# EAGLE design MEchaduino_03 (EAGLE 9.0.0)
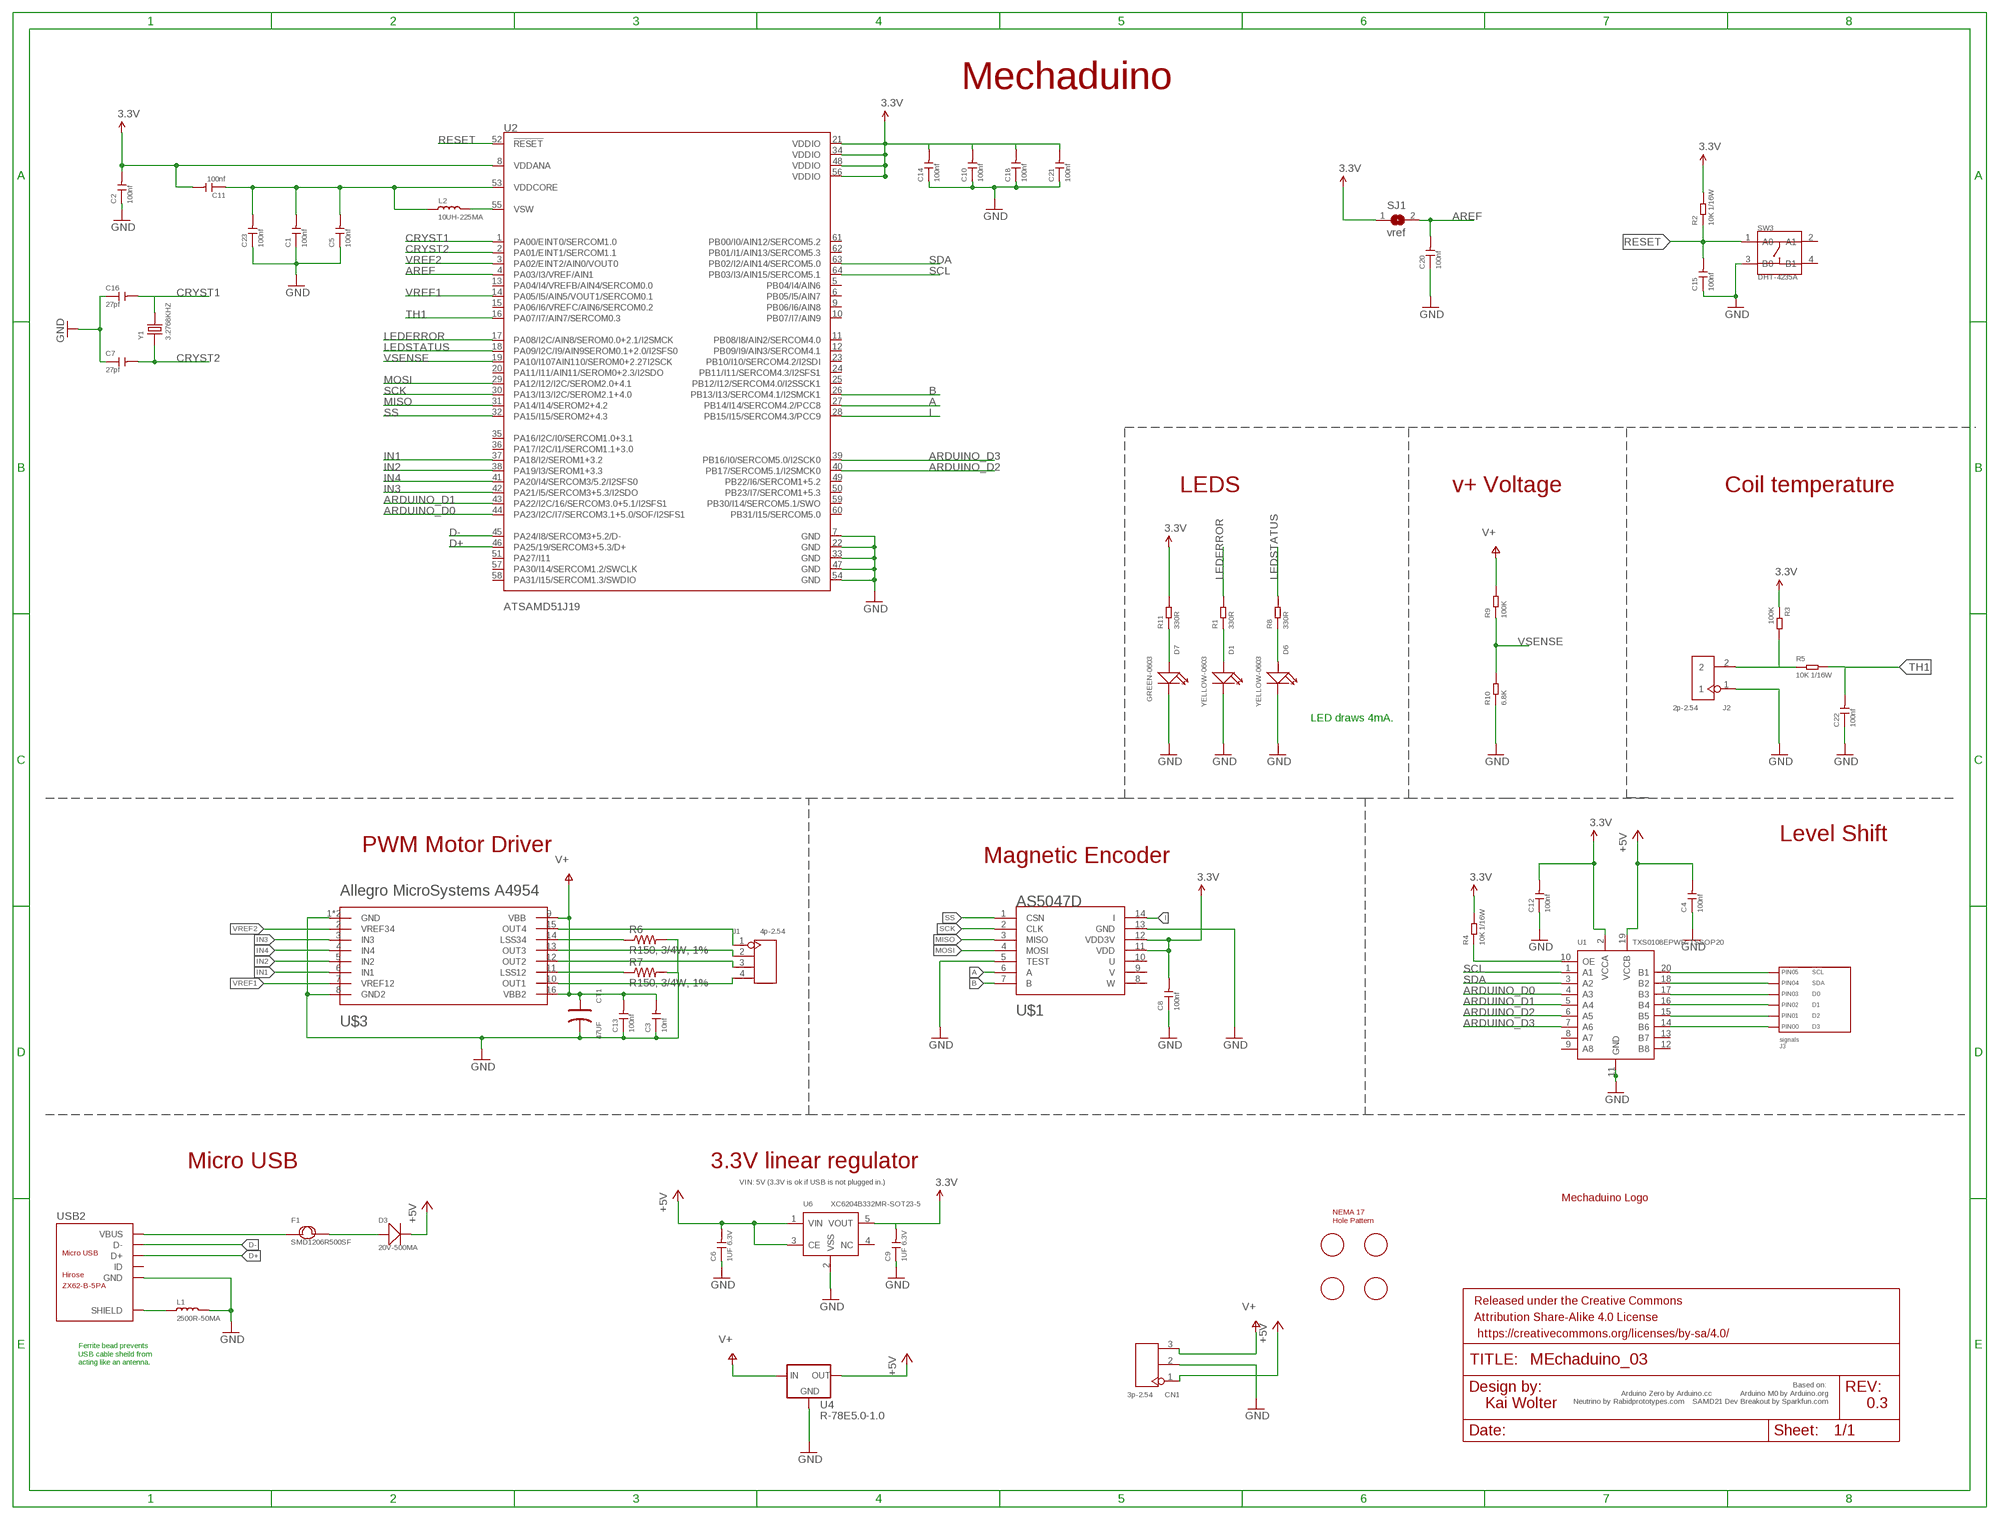
[diagram p0: schematic, sheet 1]

## Parts
C1  100nf  CERAMIC-100NF-25V-10%-X7R(0402)  [C0402]
C2  100nf  CERAMIC-100NF-25V-10%-X7R(0402)  [C0402]
C3  10nf  CERAMIC-10NF-50V-10%-X7R(0603)  [C0603]
C4  100nf  CERAMIC-100NF-25V-10%-X7R(0402)  [C0402]
C5  100nf  CERAMIC-100NF-25V-10%-X7R(0402)  [C0402]
C6  1UF 6.3V  CERAMIC-1UF-6.3V-10%-X5R(0402)  [C0402]
C7  27pf  CERAMIC-27PF-50V-5%-NPO(0402)  [C0402]
C8  100nf  CERAMIC-100NF-25V-10%-X7R(0402)  [C0402]
C9  1UF 6.3V  CERAMIC-1UF-6.3V-10%-X5R(0402)  [C0402]
C10  100nf  CERAMIC-100NF-25V-10%-X7R(0402)  [C0402]
C11  100nf  CERAMIC-100NF-25V-10%-X7R(0402)  [C0402]
C12  100nf  CERAMIC-100NF-25V-10%-X7R(0402)  [C0402]
C13  100nf  CERAMIC-100NF-50V-10%-X7R(0603)  [C0603]
C14  100nf  CERAMIC-100NF-25V-10%-X7R(0402)  [C0402]
C15  100nf  CERAMIC-100NF-25V-10%-X7R(0402)  [C0402]
C16  27pf  CERAMIC-27PF-50V-5%-NPO(0402)  [C0402]
C18  100nf  CERAMIC-100NF-25V-10%-X7R(0402)  [C0402]
C20  100nf  CERAMIC-100NF-25V-10%-X7R(0402)  [C0402]
C21  100nf  CERAMIC-100NF-25V-10%-X7R(0402)  [C0402]
C22  100nf  CERAMIC-100NF-25V-10%-X7R(0402)  [C0402]
C23  100nf  CERAMIC-100NF-25V-10%-X7R(0402)  [C0402]
CN1  3p-2.54  DIP-BLACK-MALE-HEADER-VERT(3P-2.54)  [H3-2.54]
CT1  47UF  ALUMINUM-SMD-47UF-25V(D6.3-H5.3MM)  [ELECTRO-SMD-C-6MM]
D1  YELLOW-0603  SMD-LED-CLEAR-YELLOW(0603)  [LED-0603]
D3  20V-500MA  SMD-DIODE-SCHOTTKY-20V-500MA(SOD-123)  [SOD-123]
D6  YELLOW-0603  SMD-LED-CLEAR-YELLOW(0603)  [LED-0603]
D7  GREEN-0603  SMD-LED-CLEAR-GREEN(0603)  [LED-0603]
F1  SMD1206R500SF  SMD-PPTC-500MA(1206)  [F1206]
FRAME1  FRAME-LEDGER  [CREATIVE_COMMONS]
J1  4p-2.54  DIP-BLACK-MALE-HEADER-VERT(4P-2.54)  [H4-2.54]
J2  2p-2.54  DIP-BLACK-MALE-HEADER-VERT(2P-2.54)  [H2-2.54]
J3  signals  HEADER_01X06_PTH_2.54MM  [PTH_2.54MM_01X06]
L1  2500R-50MA  SMD-FERRITE-BEAD-2500R-50MA(0603)  [L0603]
L2  10UH-225MA  SMD-INDUCTOR-10UH-225MA-10%(0806)  [L0806]
R1  330R  SMD-RES-330R-1%-1/16W(0402)  [R0402]
R2  10K 1/16W  SMD-RES-10K-1%-1/16W(0402)  [R0402]
R3  100K  SMD-RES-100K-1%-1/16W(0402)  [R0402]
R4  10K 1/16W  SMD-RES-10K-1%-1/16W(0402)  [R0402]
R5  10K 1/16W  SMD-RES-10K-1%-1/16W(0402)  [R0402]
R6  R150, 3/4W, 1%  R-US_R1206  [R1206]
R7  R150, 3/4W, 1%  R-US_R1206  [R1206]
R8  330R  SMD-RES-330R-1%-1/16W(0402)  [R0402]
R9  100K  SMD-RES-100K-1%-1/16W(0402)  [R0402]
R10  6.8K  SMD-RES-6.8K-1%-1/10W(0603)  [R0603]
R11  330R  SMD-RES-330R-1%-1/16W(0402)  [R0402]
SJ1  vref  SJ  [SJ]
SW3  DHT-4235A  SMD-BUTTON-TOP-DHT-4235A(4P-4.2X3.2MM)  [SW4-SMD-4.2X3.2X2.5MM]
U1  TXS0108EPWR-TSSOP20  LOGIC-TXS0108EPWR(TSSOP20)  [TSSOP20-0.65-6.5X4.4MM]
U2  ATSAMD51J19  [TQFP64]
U4  R-78E5.0-1.0  [DC-DC_CONVERTER_78XX]
U6  XC6204B332MR-SOT23-5  PMIC-LDO-XC6204B332MR(SOT23-5)  [SOT-23-5]
U$1  AS5047D  [TSSOP14]
U$2  NEMA17_HOLE_PATTERNNEW  [NEMA17_HOLE_PATTERN_2]
U$3  Allegro MicroSystems A4954  AVAGO_DRIVERTHERM  [TSSOP16_THERM]
U$4  MECHADUINO_LOGO  [MECHADUINO_LOGO]
USB2  ZX62-B-5PA  MICRO-USB-SMD(ZX62-B-5PA)  [MICRO-USB5+6P-SMD-0.65-AB]
Y1  3.2768KHZ  SMD-CRYSTAL-32.768KHZ-12.5PF-20PPM-90K(2P-L2.0X1.2MM)  [X2-SMD-L2.0X1.2X0.55MM]

## Nets
3.3V: C2.2 C8.2 C9.2 C10.2 C11.2 C12.2 C14.2 C18.2 C21.2 R2.2 R3.1 R4.2 R11.2 SJ1.1 U1.2(VCCA) U2.8(VDDANA) U2.21(VDDIO) U2.34(VDDIO) U2.48(VDDIO) U2.56(VDDIO) U6.5(VOUT) U$1.11(VDD) U$1.12(VDD3V)
+5V: C4.2 C6.2 CN1.1 D3.- U1.19(VCCB) U4.VOUT(OUT) U6.1(VIN) U6.3(CE)
A: U2.27(PB14/I14/SERCOM4.2/PCC8) U$1.6(A)
ARDUINO_D0: U1.4(A3) U2.44(PA23/I2C/I7/SERCOM3.1+5.0/SOF/I2SFS1)
ARDUINO_D1: U1.5(A4) U2.43(PA22/I2C/16/SERCOM3.0+5.1/I2SFS1)
ARDUINO_D2: U1.6(A5) U2.40(PB17/SERCOM5.1/I2SMCK0)
ARDUINO_D3: U1.7(A6) U2.39(PB16/I0/SERCOM5.0/I2SCK0)
AREF: C20.2 SJ1.2 U2.4(PA03/I3/VREF/AIN1)
B: U2.26(PB13/I13/SERCOM4.1/I2SMCK1) U$1.7(B)
CRYST1: C16.2 U2.1(PA00/EINT0/SERCOM1.0) Y1.2
CRYST2: C7.2 U2.2(PA01/EINT1/SERCOM1.1) Y1.1
D+ [USBpair]: U2.46(PA25/19/SERCOM3+5.3/D+) USB2.3(D+)
D- [USBpair]: U2.45(PA24/I8/SERCOM3+5.2/D-) USB2.2(D-)
GND [gnd]: C1.1 C2.1 C3.1 C4.1 C5.1 C6.1 C7.1 C8.1 C9.1 C10.1 C12.1 C13.1 C14.1 C15.1 C16.1 C18.1 C20.1 C21.1 C22.1 C23.1 CN1.2 CT1.- D1.- D6.- D7.- J2.1 L1.2 R6.2 R7.2 R10.1 SW3.3(B0) U1.11(GND) U2.7(GND) U2.22(GND) U2.33(GND) U2.47(GND) U2.54(GND) U4.GND U6.2(VSS) U$1.5(TEST) U$1.13(GND) U$3.1(GND) U$3.8(GND2) U$3.P$1(GND) USB2.5(GND)
I: U2.28(PB15/I15/SERCOM4.3/PCC9) U$1.14(I)
I_SENSE_COIL_A: R7.1 U$3.11(LSS12)
I_SENSE_COIL_B: R6.1 U$3.14(LSS34)
IN1: U2.37(PA18/I2/SEROM1+3.2) U$3.6(IN1)
IN2: U2.38(PA19/I3/SEROM1+3.3) U$3.5(IN2)
IN3: U2.42(PA21/I5/SERCOM3+5.3/I2SDO) U$3.3(IN3)
IN4: U2.41(PA20/I4/SERCOM3/5.2/I2SFS0) U$3.4(IN4)
LEDERROR: R1.2 U2.17(PA08/I2C/AIN8/SEROM0.0+2.1/I2SMCK)
LEDSTATUS: R8.2 U2.18(PA09/I2C/I9/AIN9SEROM0.1+2.0/I2SFS0)
MISO: U2.31(PA14/I14/SEROM2+4.2) U$1.3(MISO)
MOSI: U2.29(PA12/I12/I2C/SEROM2.0+4.1) U$1.4(MOSI)
N$1: D6.+ R8.1
N$2: J3.P$4(PIN3) U1.17(B3)
N$3: D1.+ R1.1
N$4: J3.P$3(PIN2) U1.16(B4)
N$5: J3.P$2(PIN1) U1.15(B5)
N$6: R4.1 U1.10(OE)
N$7: J3.P$1(PIN0) U1.14(B6)
N$8: C1.2 C5.2 C11.1 C23.2 L2.1 U2.53(VDDCORE)
N$9: J3.P$6(PIN5) U1.20(B1)
N$10: L2.2 U2.55(VSW)
N$11: D7.+ R11.1
N$12: D3.+ F1.2
N$13: J1.1 U$3.15(OUT4)
N$14: J1.4 U$3.10(OUT1)
N$15: J1.3 U$3.12(OUT2)
N$16: J1.2 U$3.13(OUT3)
N$17: J3.P$5(PIN4) U1.18(B2)
N$23: J2.2 R3.2 R5.1
RESET: C15.2 R2.1 SW3.1(A0) U2.52(!RESET!)
SCK: U2.30(PA13/I13/I2C/SEROM2.1+4.0) U$1.2(CLK)
SCL: U1.1(A1) U2.64(PB03/I3/AIN15/SERCOM5.1)
SDA: U1.3(A2) U2.63(PB02/I2/AIN14/SERCOM5.0)
SHIELD: L1.1 USB2.P1(SHIELD) USB2.P2(SHIELD) USB2.P3(SHIELD) USB2.P4(SHIELD) USB2.P5(SHIELD) USB2.P6(SHIELD)
SS: U2.32(PA15/I15/SEROM2+4.3) U$1.1(CSN)
TH1: C22.2 R5.2 U2.16(PA07/I7/AIN7/SERCOM0.3)
V+: C3.2 C13.2 CN1.3 CT1.+ R9.2 U4.VIN(IN) U$3.9(VBB) U$3.16(VBB2)
VBUS [usbvcc]: F1.1 USB2.1(VBUS)
VREF1: U2.14(PA05/I5/AIN5/VOUT1/SERCOM0.1) U$3.7(VREF12)
VREF2: U2.3(PA02/EINT2/AIN0/VOUT0) U$3.2(VREF34)
VSENSE: R9.1 R10.2 U2.19(PA10/I107AIN110/SEROM0+2.27I2SCK)
Unconnected: SW3.2(A1) SW3.4(B1) U1.8(A7) U1.9(A8) U1.12(B8) U1.13(B7) U2.5(PB04/I4/AIN6) U2.6(PB05/I5/AIN7) U2.9(PB06/I6/AIN8) U2.10(PB07/I7/AIN9) U2.11(PB08/I8/AIN2/SERCOM4.0) U2.12(PB09/I9/AIN3/SERCOM4.1) U2.13(PA04/I4/VREFB/AIN4/SERCOM0.0) U2.15(PA06/I6/VREFC/AIN6/SERCOM0.2) U2.20(PA11/I11/AIN11/SEROM0+2.3/I2SDO) U2.23(PB10/I10/SERCOM4.2/I2SDI) U2.24(PB11/I11/SERCOM4.3/I2SFS1) U2.25(PB12/I12/SERCOM4.0/I2SSCK1) U2.35(PA16/I2C/I0/SERCOM1.0+3.1) U2.36(PA17/I2C/I1/SERCOM1.1+3.0) U2.49(PB22/I6/SERCOM1+5.2) U2.50(PB23/I7/SERCOM1+5.3) U2.51(PA27/I11) U2.57(PA30/I14/SERCOM1.2/SWCLK) U2.58(PA31/I15/SERCOM1.3/SWDIO) U2.59(PB30/I14/SERCOM5.1/SWO) U2.60(PB31/I15/SERCOM5.0) U2.61(PB00/I0/AIN12/SERCOM5.2) U2.62(PB01/I1/AIN13/SERCOM5.3) U6.4(NC) U$1.8(W) U$1.9(V) U$1.10(U) USB2.4(ID)

## Notes on the sheet
- Mechaduino
- LEDS | v+ Voltage | Coil temperature
- LED draws 4mA.
- Level Shift
- PWM Motor Driver
- Magnetic Encoder
- Micro USB | 3.3V linear regulator
- VIN: 5V (3.3V is ok if USB is not plugged in.)
- Ferrite bead prevents 
  USB cable sheild from 
  acting like an antenna.
- Based on: 
  Arduino Zero by Arduino.cc              Arduino M0 by Arduino.org
  Neutrino by Rabidprototypes.com    SAMD21 Dev Breakout by Sparkfun.com
- Kai Wolter | 0.3

## Library data of the parts
C1 C2 C4 C5 C8 C10-C12 C14 C15 C18 C20-C23 = Seeed-Capacitor:CERAMIC-100NF-25V-10%-X7R(0402): 302010024; MPN: CC0402KRX7R8BB104
C3 = Seeed-Capacitor:CERAMIC-10NF-50V-10%-X7R(0603): 302010140; MPN: CC0603KRX7R9BB103
C6 C9 = Seeed-Capacitor:CERAMIC-1UF-6.3V-10%-X5R(0402): 302010003; MPN: CC0402KRX5R5BB105
C7 C16 = Seeed-Capacitor:CERAMIC-27PF-50V-5%-NPO(0402): 302010027; MPN: CC0402JRNPO9BN270
C13 = Seeed-Capacitor:CERAMIC-100NF-50V-10%-X7R(0603): 302010138; MPN: CC0603KRX7R9BB104
CN1 = Seeed-Connector:DIP-BLACK-MALE-HEADER-VERT(3P-2.54): 320020079
CT1 = Seeed-Capacitor:ALUMINUM-SMD-47UF-25V(D6.3-H5.3MM): 302030059; MPN: CS1E470M-CRE54; SEEEDSKU: 302030099
D1 D6 = Seeed-LED:SMD-LED-CLEAR-YELLOW(0603): 304090044; MPN: 19-217-Y5C-AM1N1VY-3T
D3 = Seeed-Diode:SMD-DIODE-SCHOTTKY-20V-500MA(SOD-123): 304020032; MPN: SS0520-7-F
D7 = Seeed-LED:SMD-LED-CLEAR-GREEN(0603): 304090043; MPN: 19-217-G7C-AN1P2-3T
F1 = Seeed-Fuse:SMD-PPTC-500MA(1206): 307010002; MPN: SMD1206R500SF
FRAME1 = SparkFun-Aesthetics:FRAME-LEDGER: Schematic Frame - Ledger Standard 11x14 US Ledger frame
J1 = Seeed-Connector:DIP-BLACK-MALE-HEADER-VERT(4P-2.54): 320020017; MPN: P125-1104A0BS116A1
J2 = Seeed-Connector:DIP-BLACK-MALE-HEADER-VERT(2P-2.54): 320020016; MPN: P125-1102A0BS116A1
J3 = MF_Connectors:HEADER_01X06: Library: MF_Connectors Description: Header Connector with 6 Positions and 01 Rows. Use the LABEL Attribute to label the pin on the schematic and PCB. You can remove the attributes on the PCB by using the SMASH function on the part and then deleting the text.; LABEL00: D3; LABEL01: D2; LABEL02: D1; LABEL03: D0; LABEL04: SDA; LABEL05: SCL
L1 = Seeed-Inductor:SMD-FERRITE-BEAD-2500R-50MA(0603): 303030020
L2 = Seeed-Inductor:SMD-INDUCTOR-10UH-225MA-10%(0806): 303010042; MPN: LQH2MCN100K02L
R1 R8 R11 = Seeed-Resistor:SMD-RES-330R-1%-1/16W(0402): 301010466; MPN: RC0402FR-07330RL
R2 R4 R5 = Seeed-Resistor:SMD-RES-10K-1%-1/16W(0402): 301010047; MPN: RC0402FR-0710KL
R3 R9 = Seeed-Resistor:SMD-RES-100K-1%-1/16W(0402): 301010456; MPN: RC0402FR-07100KL
R6 R7 = adafruit:R-US_: RESISTOR, American symbol; MPN: KRL1632E-M-R150-F-T5
R10 = Seeed-Resistor:SMD-RES-6.8K-1%-1/10W(0603): 301010198; MPN: RC0805JR-07220KL
SJ1 = jumper:SJ: SMD solder JUMPER
SW3 = Seeed-Switch:SMD-BUTTON-TOP-DHT-4235A(4P-4.2X3.2MM): 311020045; MPN: DHT-4235A
U1 = Seeed-IC:LOGIC-TXS0108EPWR(TSSOP20): 310050026; MPN: TXS0108EPWR
U2 = atsamd51:ATSAMD51J19: Atmel SAMD21G SMART ARM-Based Microcontroller The Atmel ® | SMART ™ SAM D21 is a series of low-power microcontrollers using the 32-bit ARM ® Cortex ® -M0+ processor, and ranging from 32- to 64-pins with up to 256KB Flash and 32KB of SRAM. The SAM D21 devices operate at a maximum frequency of 48MHz and reach 2.46 CoreMark/MHz. They are designed for simple and intuitive migration with identical peripheral modules, hex compatible code, identical linear address map and pin compatible migration paths between all devices in the product series. All devices include intelligent and flexible peripherals, Atmel Event System for inter-peripheral signaling, and support for capacitive touch button, slider and wheel user interfaces. Datasheet <http://ww1.microchip.com/downloads/en/DeviceDoc/SAM-D5xE5x-Family-Datasheet-01507B.pdf>; MPN: ATSAMD51J19A-AU
U4 = SparkFun-IC-Power:R-78E5.0-1.0: Recom Power 5V 1A DC/DC Converter The Recom R-78E5.0-X.X is a compact DC/DC converter module that is a pin for pin drop-in replacement for the LM7805 linear voltage regulator. Specifications: Input Range: 7-28V Output Voltage: 5V Output Current: 1A Max Efficiency: 91% Datasheet <https://www.recom-power.com/pdf/Innoline/R-78Exx-1.0.pdf>; PROD_ID: COM-13655
U6 = Seeed-IC:PMIC-LDO-XC6204B332MR(SOT23-5): 310030046; MPN: XC6204B332MR
U$1 = stepper_servo_prototype_1:AS5047D: AMS: AS5047D-ATSM Mouser: 985-AS5047D-ATSM; MPN: AS5047D-ATSM
U$2 = stepper_servo_prototype_1:NEMA17_HOLE_PATTERN
U$3 = avagopack:AVAGO_DRIVER: Allegro MicroSystems, LLC: A4954ELPTR-T Digi-Key: 620-1384-1-ND; MPN: A4953ELJTR-T
U$4 = stepper_servo_prototype_1:MECHADUINO_LOGO
USB2 = Seeed-Connector:MICRO-USB-SMD(ZX62-B-5PA): 320010005; MPN: ZX62-B-5PA
Y1 = Seeed-Crystal Oscillator:SMD-CRYSTAL-32.768KHZ-12.5PF-20PPM-90K(2P-L2.0X1.2MM): 306010020; MPN: FC-12M

## Net classes
2 gnd: width 0.152 mm, drill 0.305 mm, clearance 0.152 mm
3 usbvcc: width 0.152 mm, drill 0.305 mm, clearance 0.152 mm
4 USBpair: width 0.152 mm, drill 0.305 mm, clearance 0.152 mm

## Board
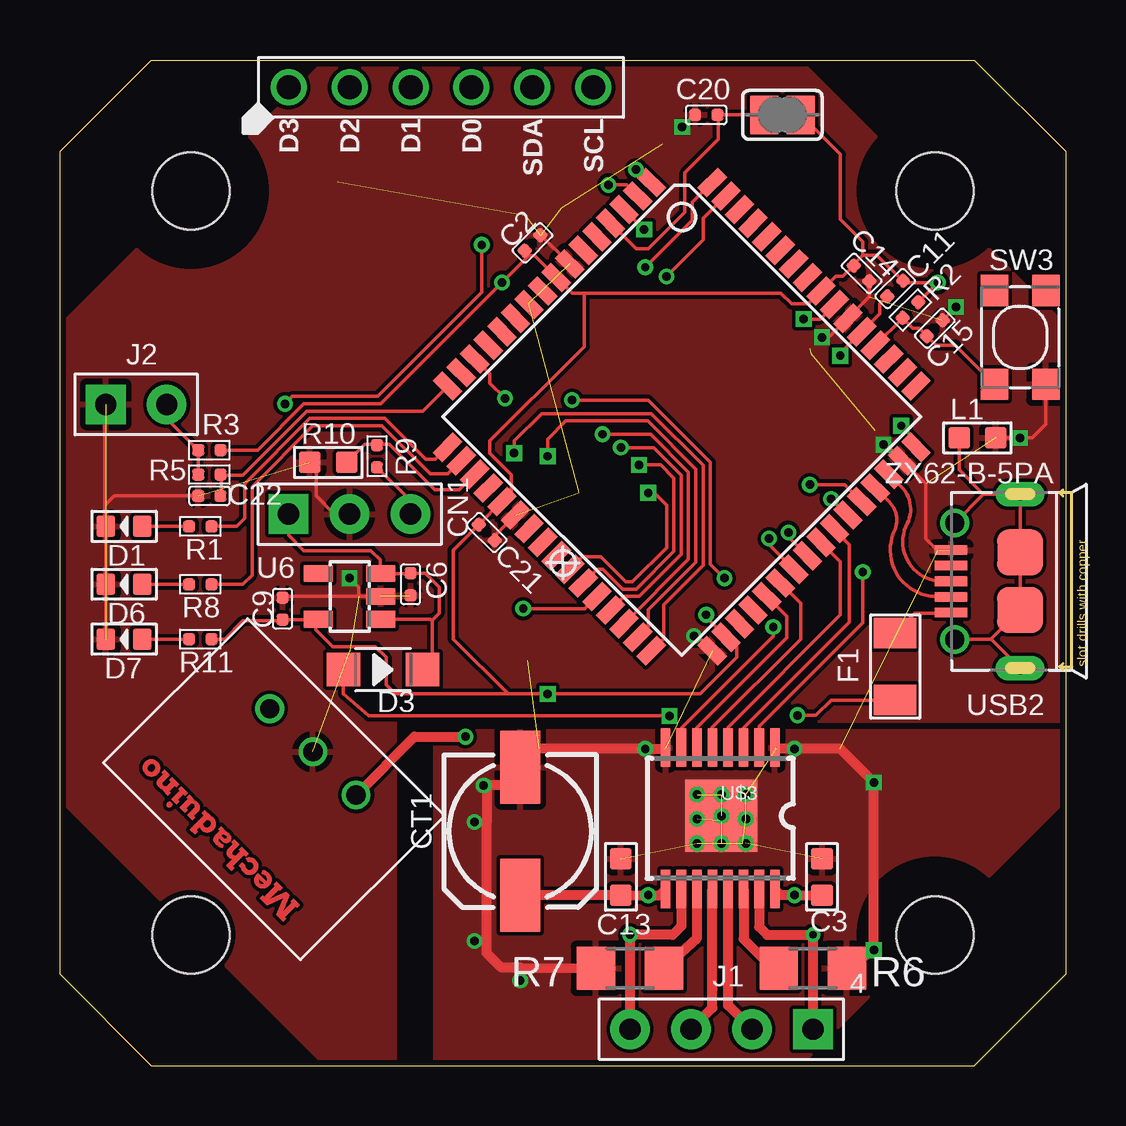
[diagram p1: board, top side]
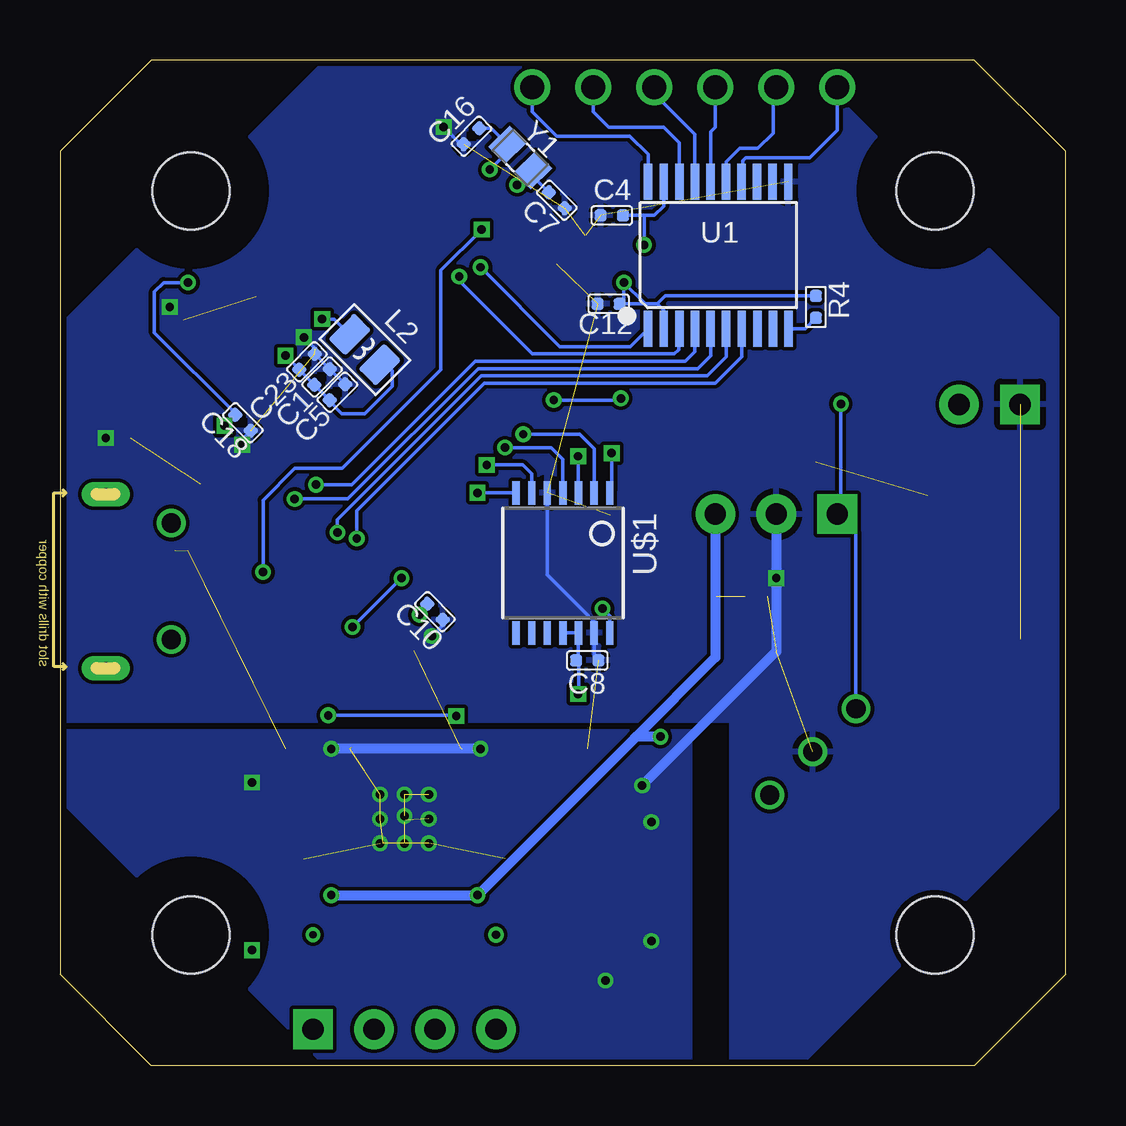
[diagram p2: board, bottom side, seen from below]

Size 41.91 x 41.91 mm. Coordinates in mm from the lower left corner, seen from the top.
Outline: 3.81,0 38.1,0 41.91,3.81 41.91,38.1 38.1,41.91 3.81,41.91 0,38.1 0,3.81 3.81,0
Copper layers (1*16): Top 0.035mm / dielectric 0.2mm / Bottom 0.035mm
Design rules "MacroFabDRU *": minimum track width 6mil, minimum drill 12mil, track to track 6mil, track to pad 6mil, pad to pad 6mil, via to via 6mil, smd to smd 0mil, copper to edge 10mil, drill to drill 10mil, minimum pad ring 6mil, minimum via ring 6mil, stop-mask expansion 2mil, vias tented up to drill 25mil, thermal gap 10mil

### Footprints (pad centres in the part's own frame; a part is rotated, then mirrored left to right if it is on the bottom)
C0402 = smd 0.5 x 0.5: 1 0,0.463; 2 0,-0.463
C0603 = smd 0.889 x 0.889: 1 0,0.762; 2 0,-0.762
H3-2.54 = drill 0.889 pad 1.651 square: 1 0,2.54 | drill 0.889 pad 1.651: 2 0,0; 3 0,-2.54
ELECTRO-SMD-C-6MM = smd 3.048 x 1.651: + 2.667,0; - -2.667,0
LED-0603 = smd 0.762 x 0.889: + -0.762,0; - 0.762,0
SOD-123 = smd 1.397 x 1.397: + -1.651,0; - 1.651,0
F1206 = smd 1.27 x 1.778: 1 -1.397,0; 2 1.397,0
H4-2.54 = drill 0.889 pad 1.651 square: 1 0,3.81 | drill 0.889 pad 1.651: 2 0,1.27; 3 0,-1.27; 4 0,-3.81
H2-2.54 = drill 0.889 pad 1.651 square: 1 0,1.27 | drill 0.889 pad 1.651: 2 0,-1.27
PTH_2.54MM_01X06 = drill 1: P$1 -6.35,0; P$2 -3.81,0; P$3 -1.27,0; P$4 1.27,0; P$5 3.81,0; P$6 6.35,0
L0603 = smd 0.889 x 0.889: 1 -0.762,0; 2 0.762,0
L0806 = smd 1.016 x 1.524: 1 -0.889,0; 2 0.889,0
R0402 = smd 0.5 x 0.5: 1 0,0.463; 2 0,-0.463
R1206 = smd 1.6 x 1.803: 1 -1.422,0; 2 1.422,0
R0603 = smd 0.889 x 0.889: 1 0,0.762; 2 0,-0.762
SJ = smd 1.168 x 1.6: 1 -0.762,0; 2 0.762,0
SW4-SMD-4.2X3.2X2.5MM = smd 1.3 x 1.15: 1 -1.95,1.075; 2 1.95,1.075; 3 -1.95,-1.075; 4 1.95,-1.075
TSSOP20-0.65-6.5X4.4MM = smd 0.35 x 1.5: 1 -2.925,-3.065; 2 -2.275,-3.065; 3 -1.625,-3.065; 4 -0.975,-3.065; 5 -0.325,-3.065; 6 0.325,-3.065; 7 0.975,-3.065; 8 1.625,-3.065; 9 2.275,-3.065; 10 2.925,-3.065; 11 2.91,3.065; 12 2.26,3.065; 13 1.61,3.065; 14 0.96,3.065; 15 0.325,3.065; 16 -0.325,3.065; 17 -0.975,3.065; 18 -1.625,3.065; 19 -2.275,3.065; 20 -2.925,3.065
TQFP64 = smd 1.194 x 0.559: 1 -7.8,6; 2 -7.8,5.2; 3 -7.8,4.4; 4 -7.8,3.6; 5 -7.8,2.8; 6 -7.8,2; 7 -7.8,1.2; 8 -7.8,0.4; 9 -7.8,-0.4; 10 -7.8,-1.2; 11 -7.8,-2; 12 -7.8,-2.8; 13 -7.8,-3.6; 14 -7.8,-4.4; 15 -7.8,-5.2; 16 -7.8,-6; 33 7.8,-6; 34 7.8,-5.2; 35 7.8,-4.4; 36 7.8,-3.6; 37 7.8,-2.8; 38 7.8,-2; 39 7.8,-1.2; 40 7.8,-0.4; 41 7.8,0.4; 42 7.8,1.2; 43 7.8,2; 44 7.8,2.8; 45 7.8,3.6; 46 7.8,4.4; 47 7.8,5.2; 48 7.8,6 | smd 0.559 x 1.194: 17 -6,-7.8; 18 -5.2,-7.8; 19 -4.4,-7.8; 20 -3.6,-7.8; 21 -2.8,-7.8; 22 -2,-7.8; 23 -1.2,-7.8; 24 -0.4,-7.8; 25 0.4,-7.8; 26 1.2,-7.8; 27 2,-7.8; 28 2.8,-7.8; 29 3.6,-7.8; 30 4.4,-7.8; 31 5.2,-7.8; 32 6,-7.8; 49 6,7.8; 50 5.2,7.8; 51 4.4,7.8; 52 3.6,7.8; 53 2.8,7.8; 54 2,7.8; 55 1.2,7.8; 56 0.4,7.8; 57 -0.4,7.8; 58 -1.2,7.8; 59 -2,7.8; 60 -2.8,7.8; 61 -3.6,7.8; 62 -4.4,7.8; 63 -5.2,7.8; 64 -6,7.8
DC-DC_CONVERTER_78XX = drill 0.8: GND 0,0; VIN -2.54,0; VOUT 2.54,0
SOT-23-5 = smd 0.69 x 1.2: 1 -0.95,-1.3; 2 0,-1.3; 3 0.95,-1.3; 4 0.95,1.3; 5 -0.95,1.3
TSSOP14 = smd 0.305 x 0.991: 1 -1.95,-2.918; 2 -1.3,-2.918; 3 -0.65,-2.918; 4 0,-2.918; 5 0.65,-2.918; 6 1.3,-2.918; 7 1.95,-2.918; 8 1.95,2.918; 9 1.3,2.918; 10 0.65,2.918; 11 0,2.918; 12 -0.65,2.918; 13 -1.3,2.918; 14 -1.95,2.918
NEMA17_HOLE_PATTERN_2 = hole 3.2: -15.5,15.5; -15.5,-15.5; 15.5,-15.5; 15.5,15.5
TSSOP16_THERM = smd 0.4 x 1.6: 1 -2.225,-2.85; 2 -1.575,-2.85; 3 -0.925,-2.85; 4 -0.275,-2.85; 5 0.375,-2.85; 6 1.025,-2.85; 7 1.675,-2.85; 8 2.325,-2.85; 9 2.325,3.05; 10 1.675,3.05; 11 1.025,3.05; 12 0.375,3.05; 13 -0.275,3.05; 14 -0.925,3.05; 15 -1.575,3.05; 16 -2.225,3.05 | smd 3 x 3: P$1 0,0
MICRO-USB5+6P-SMD-0.65-AB = smd 0.4 x 1.35: 1 -1.3,2.875; 2 -0.65,2.875; 3 0,2.875; 4 0.65,2.875; 5 1.3,2.875 | smd 1.9 x 1.9: P1 -1.2,0; P2 1.2,0 | drill 0.508 pad 1.016 long: P3 -3.625,0; P4 3.625,0 | drill 0.8: P5 -2.425,2.73; P6 2.425,2.73
X2-SMD-L2.0X1.2X0.55MM = smd 1 x 1.25: 1 -0.75,0; 2 0.75,0

### Placement (x,y rotation side)
C1  30.99,28.7 315 bottom
C2  19.68,34.29 315 top
C3  31.75,7.87 0 top
C4  18.92,35.43 90 bottom
C5  30.35,28.07 315 bottom
C6  14.61,20.07 180 top
C7  21.21,36.07 225 bottom
C8  19.94,16.89 270 bottom
C9  9.27,19.05 0 top
C10  26.29,18.92 225 bottom
C11  34.8,32.38 135 top
C12  19.05,31.75 90 bottom
C13  23.37,7.87 0 top
C14  33.4,33.02 225 top
C15  36.45,30.73 315 top
C16  24.77,38.73 135 bottom
C18  34.29,26.8 225 bottom
C20  26.92,39.62 90 top
C21  17.78,22.23 225 top
C22  6.22,23.75 90 top
C23  31.62,29.34 315 bottom
CN1  12.06,22.99 90 top
CT1  19.18,9.78 270 top
D1  2.67,22.48 180 top
D3  13.46,16.51 0 top
D6  2.67,20.07 180 top
D7  2.67,17.78 180 top
F1  34.8,16.64 270 top
FRAME1  0.61,-10.16 0 top  (outside the outline)
J1  27.56,1.52 270 top
J2  3.17,27.56 90 top
J3  15.88,40.77 0 top
L1  38.23,26.16 0 top
L2  29.21,29.84 135 bottom
R1  5.84,22.48 90 top
R2  35.43,31.5 135 top
R3  6.22,25.65 270 top
R4  10.41,31.62 180 bottom
R5  6.22,24.64 90 top
R6  31.37,4.06 0 top
R7  23.75,4.06 180 top
R8  5.84,20.07 90 top
R9  13.21,25.4 0 top
R10  11.18,25.15 90 top
R11  5.84,17.78 90 top
SJ1  30.1,39.62 180 top
SW3  40.01,30.35 90 top
U1  14.48,33.78 0 bottom
U2  25.91,27.05 315 top
U4  10.54,13.08 135 top
U6  12.06,19.56 90 top
U$1  20.95,20.95 180 bottom
U$2  20.95,20.95 0 top
U$3  27.56,10.41 180 top
U$4  10.16,6.73 135 top
USB2  40.01,20.19 90 top
Y1  22.73,37.85 135 bottom

### Tracks (layer width: path | path; a pad name or v marks a point on that pad's centre or on a via)
3.3V  (via drill 0.35)
  Top 0.152: C21.2 16.38,21.49 16.38,17.78 18.67,15.49 | C21.2 U2.21 18.8,23.9 18.8,24.64 17.91,25.53 17.91,26.04 21.53,29.65 21.84,29.97 21.84,32.19 | U2.48 35.67,26.06 v35.05,26.67 | SJ1.1 32.51,37.97 32.51,35.28 33.46,34.34 33.46,33.78 | 18.67,15.49 v20.32,15.49 26.67,15.49 28.19,17.02 28.19,17.47 27.81,17.86 U2.34 26.92,18.68 | 36.45,32.64 v36.58,32.64 | 26.92,18.68 v26.92,18.8 | 26.92,18.67 26.92,18.68 | 19.57,33.75 19.52,33.75 v18.41,32.64 13.36,27.58 10.16,27.58 8.23,25.65 R3.1 | 21.84,32.19 21.34,32.19 U2.8 19.78,33.75 19.57,33.75 | 21.84,32.19 30.04,32.19 30.48,31.75 31.17,31.75 U2.56 32.32,32.89 32.62,32.89 C14.2 33.07,33.4 33.46,33.78 | 18.67,15.49 13.97,15.49 13.59,15.88 13.59,17.02 13.14,17.47 11.36,17.47 10.66,18.17 10.66,18.55 10.62,18.59 | 33.46,33.78 34.04,33.78 35.11,32.71 C11.2 35.2,32.64 36.45,32.64 | C21.2 | R11.2 6.86,17.78 7.62,18.54 9.23,18.54 C9.2 10.62,18.59 | R2.2 36.45,32.51 36.45,32.64 | U6.5 10.74,18.59 10.62,18.59 | C2.2 19.57,33.75
  Bottom 0.152: v35.05,26.67 34.57,27.15 34.62,27.2 | v20.32,15.49 20.3,15.51 20.3,16.79 C8.2 20.31,16.98 20.31,18.03 U$1.12 U$1.11 | 34.62,27.2 37.97,30.55 37.97,32.26 37.59,32.64 v36.58,32.64 | 17.57,31.8 v18.41,32.64 18.41,31.92 C12.2 | C18.2 34.62,27.2 | C10.2 26.92,18.94 v26.92,18.8 | C12.2 17.02,31.75 | U1.2 16.75,31.48 17.02,31.75 | C12.2 18.54,31.7 | R4.2 16.68,32.09 17.02,31.75
+5V  (via drill 0.35)
  Top 0.152: 15.5,18.54 15.43,18.61 U6.1 | 15.5,18.54 15.52,18.52 15.52,17.02 | v9.37,27.58 9.68,27.89 13.23,27.89 17.57,32.23 v17.57,34.21 | 15.52,17.02 15.52,16.79 | 15.5,18.54 15.8,18.85 15.8,19.94 15.21,20.53 C6.2 14.59,20.51 U6.3 13.34,20.54 13.34,21.08 12.95,21.46 10.16,21.46 9.53,22.1 CN1.1 | D3.- 15.52,17.02
  Bottom 0.152: v9.37,27.58 9.37,23.14 CN1.1 8.74,22.21 U4.VOUT | U1.19 16.76,36.84 16.76,35.81 17.14,35.43 17.53,35.43 | 17.53,35.43 C4.2 | v17.57,34.21 17.57,35.39 17.53,35.43
A  (via drill 0.35)
  Top 0.152: v24.13,25.04 25.03,25.04 25.58,24.49 25.58,21.44 24,19.86 23.44,19.86 22.61,20.7 22.39,20.7 U2.27
  Bottom 0.152: v24.13,25.04 22.63,25.04 22.25,24.67 U$1.6
ARDUINO_D0  (via drill 0.35)
  Top 0.152: U2.44 32.7,24.22 v31.24,24.22
  Bottom 0.152: v31.24,24.22 29.76,24.22 24.61,29.36 15.85,29.36 15.45,29.76 U1.4
ARDUINO_D1  (via drill 0.35)
  Top 0.152: v32.13,23.62 32.8,22.95 U2.43
  Bottom 0.152: 32.09,23.66 v32.13,23.62 29.92,23.62 24.49,29.05 15.35,29.05 14.8,29.6 U1.5
ARDUINO_D2  (via drill 0.35)
  Top 0.152: U2.40 30.35,22.04 v30.35,22.23
  Bottom 0.152: v30.35,22.23 30.35,22.76 24.36,28.75 14.94,28.75 14.15,29.54 U1.6
ARDUINO_D3  (via drill 0.35)
  Top 0.152: U2.39 29.55,21.72 v29.55,21.97
  Bottom 0.152: v29.55,21.97 29.55,23.13 24.24,28.44 14.61,28.44 13.5,29.55 U1.7
AREF
  Top 0.152: U2.4 24.01,34.04 24.51,34.04 26.04,35.56 26.04,37.21 27.43,38.61 27.43,39.62 | C20.2 27.43,39.62 | 27.43,39.62 SJ1.2
B  (via drill 0.35)
  Top 0.152: v24.51,23.88 24.77,23.88 25.27,23.37 25.27,21.59 23.85,20.17 23.57,20.17 22.53,21.21 21.76,21.21 U2.26
  Bottom 0.152: v24.51,23.88 23.11,23.88 | 23.11,23.88 U$1.7 | U$1.7 23.11,23.87 23.11,23.88
CRYST1  (via drill 0.35)
  Top 0.152: U2.1 24.53,36.81 v24,37.34
  Bottom 0.152: Y1.2 23.62,38.25 | v24,37.34 23.26,38.08 Y1.2 | C16.2 23.95,39.06 Y1.2
CRYST2  (via drill 0.35)
  Top 0.152: U2.2 23.61,36.7 v22.86,36.7
  Bottom 0.152: v22.86,36.7 22.82,36.7 Y1.1 22.2,37.06 C7.2
D+
  Top 0.152: U2.46 35.05,24.13 arc-71 35.31,22.61 arc116 36.7,20.19 USB2.3
D-
  Top 0.152: U2.45 34.54,23.5 arc-66 34.8,22.35 arc114 36.45,19.56 36.46,19.54 USB2.2
GND  (via drill 0.35)  (33 unrouted)
  Top 0.152: 12.45,19.56 9.32,19.56 | 9.32,19.56 9.15,19.56 | 12.45,19.56 12.45,19.94 v12.06,20.32 | 18.01,21.98 18.08,22.05 | 18.08,22.05 U2.22 | v34.31,25.88 34.43,25.88 U2.47 36.07,24.25 36.07,21.97 36.58,21.46 36.58,21.47 | v31.75,30.35 32.04,30.35 U2.54 33.73,32.04 C14.1 | U2.33 26.57,17.91 v26.42,17.91 | 1.87,23.37 1.87,27.4 | 1.87,23.37 2.25,23.75 C22.1 | 17.78,5.21 v17.27,5.21 | 17.78,10.15 17.29,10.15 v17.27,10.16 | 19.18,4.09 v19.18,3.56 | U2.7 20.04,34.62 C2.1 | 28.45,9.27 v28.57,9.27 | 24.45,13.14 v24.38,13.21 | 30.54,13.14 v30.61,13.21 | C21.1 18.11,22.02 18.08,22.05 | C20.1 26.43,39.62 v25.92,39.12 v25.92,39.11 | C15.1 v37.34,31.62 | U$3.P$1 27.5,10.22 27.56,10.16 | v17.65,11.68 17.78,11.56 | 14.56,19.56 C6.1 | C9.1 9.32,19.56 | SW3.3 41.08,26.73 40.51,26.16 v40.01,26.16 L1.2 | R10.1 10.67,24.89 10.67,23.75 11.43,22.99 CN1.2 | D7.- D6.- D1.- 1.87,23.37 | U6.2 12.45,19.56
  Top 0.406: 25.18,13.21 v24.38,13.21 19.94,13.21 CT1.- 18.41,11.68 v17.65,11.68 | 29.84,13.21 v30.61,13.21 32.51,13.21 v33.91,11.81 v33.91,4.82 R6.2 | 17.78,11.56 17.78,10.15 17.78,5.21 17.78,4.7 18.39,4.09 19.18,4.09 R7.2
  Bottom 0.152: v31.75,30.35 31.27,29.87 | v26.42,17.91 25.97,18.35 | 25.97,18.35 25.81,18.52 | 19.66,16.98 19.66,17.07 | 19.66,17.07 U$1.13 19.66,18.51 21.61,20.46 U$1.5 | C23.1 C1.1 C5.1 | C18.1 34.31,26.12 v34.31,25.88 | C10.1 25.97,18.59 25.97,18.35 | C8.1 19.66,17.07 | C16.1 25.22,38.41 v25.92,39.12
  Bottom 0.406: v24.38,13.21 v30.61,13.21 | v17.65,11.68 12.06,17.27 CN1.2
  other vias: 28.57,10.29 28.57,11.3 26.54,11.3 26.54,9.27 26.54,10.29 27.56,11.3 27.56,9.27 27.56,10.41
  pour Bottom: 15.62,0 15.62,13.97 41.91,13.97 41.91,0
  pour Top: 15.62,0 15.62,13.97 41.91,13.97 41.91,0
  pour Bottom: 13.84,0 0,0 0,41.91 41.91,41.91 41.91,14.35 13.97,14.35 13.97,0.13
  pour Top: 13.84,0 0,0 0,41.91 41.91,41.91 41.91,14.35 13.97,14.35 13.97,0.13
I  (via drill 0.35)
  Top 0.152: v19.3,19.05 21.87,19.05 U2.28
  Bottom 0.152: v19.3,19.05 19,18.75 U$1.14
I_SENSE_COIL_A
  Top 0.152: 26.55,5.33 26.53,5.34
  Top 0.406: U$3.11 26.53,5.34 | R7.1 26.55,5.33
I_SENSE_COIL_B
  Top 0.152: 28.48,5.28 28.5,5.27 | 29.7,4.06 R6.1
  Top 0.406: U$3.14 28.48,5.28 | 28.5,5.27 29.7,4.06
IN1
  Top 0.152: U2.37 30.27,18.73 30.27,17.83 26.53,14.09 U$3.6
IN2
  Top 0.152: U2.38 30.86,19.27 30.86,17.78 27.18,14.1 U$3.5
IN3
  Top 0.152: U2.42 32.34,22.31 32.34,22.27 32.89,21.72 32.89,18.49 28.48,14.08 U$3.3
IN4
  Top 0.152: U2.41 32.51,21.01 32.51,18.8 27.83,14.12 U$3.4
LEDERROR
  Top 0.152: U2.17 15.64,25.27 15.24,25.27 13.54,26.98 10.41,26.98 7.7,24.26 7.7,22.81 7.37,22.48 R1.2
LEDSTATUS
  Top 0.152: U2.18 16.17,24.66 15.42,24.66 13.41,26.67 10.54,26.67 8,24.13 8,20.45 7.62,20.07 R8.2
MISO  (via drill 0.35)
  Top 0.152: v20.32,25.4 20.32,26.11 21.08,26.87 24.48,26.87 26.49,24.87 26.49,20.98 24.51,19 24.51,18.3 U2.31
  Bottom 0.152: v20.32,25.4 20.32,24.13 20.32,23.89 U$1.3
MOSI  (via drill 0.35)
  Top 0.152: v23.37,25.76 24.73,25.76 25.15,25.34 25.88,24.61 25.88,21.31 24.13,19.56 23.5,19.56 23.5,19.55 U2.29
  Bottom 0.152: v23.37,25.76 21.44,25.76 20.95,25.27 U$1.4
N$1
  Top 0.152: D6.+ R8.1
N$2
  Bottom 0.152: U1.17 15.45,38.82 17.14,40.51 J3.P$4
N$3
  Top 0.152: D1.+ R1.1
N$4
  Bottom 0.152: J3.P$3 14.61,39.12 14.8,38.92 U1.16
N$5
  Bottom 0.152: J3.P$2 12.19,40.64 12.19,38.86 12.83,38.23 13.59,38.23 14.15,37.66 U1.15
N$6
  Bottom 0.152: R4.1 10.86,30.72 U1.10
N$7
  Bottom 0.152: J3.P$1 9.53,38.99 10.67,37.85 13.34,37.85 13.46,37.72 13.46,36.9 U1.14
N$8  (via drill 0.35)
  Top 0.152: v32.51,29.59 32.51,29.7 U2.53 34.16,31.35 34.16,31.75 C11.1
  Bottom 0.152: v32.51,29.59 31.95,29.03 C23.2 C1.2 C5.2 30.68,27.69 30.17,27.18 29.21,27.18 28.07,28.32 28.07,28.96 28.33,29.22 L2.1
N$9
  Bottom 0.152: U1.20 17.4,37.97 18.16,38.73 21.21,38.73 22.23,39.75 J3.P$6
N$10  (via drill 0.35)
  Top 0.152: v30.99,31.12 31.67,31.12 U2.55
  Bottom 0.152: v30.99,31.12 30.48,31.11 L2.2
N$11
  Top 0.152: D7.+ R11.1
N$12  (via drill 0.35)
  Top 0.152: v30.73,14.61 31.5,14.61 32.13,15.24 F1.2 | v25.4,14.58 12.85,14.58 11.81,15.49 D3.+
  Bottom 0.152: v30.73,14.61 25.43,14.61 v25.4,14.58
N$13  (via drill 0.3)
  Top 0.152: 29.13,5.79 29.15,5.78
  Top 0.406: 29.15,5.78 29.46,5.46 v31.37,5.46 J1.1 | U$3.15 29.13,5.79
N$14  (via drill 0.35)
  Top 0.152: 25.88,5.84 25.9,5.83
  Top 0.406: 25.9,5.83 25.53,5.46 v23.75,5.46 J1.4 | U$3.10 25.88,5.84
N$15
  Top 0.406: U$3.12 27.18,3.21 27.18,2.42 J1.3
N$16
  Top 0.406: U$3.13 27.83,3.15 27.83,2.52 J1.2
N$17
  Bottom 0.152: U1.18 16.1,38.45 16.76,39.12 19.05,39.12 19.68,39.75 J3.P$5
N$23
  Top 0.152: R5.1 R3.2 4.45,26.97 J2.2
RESET
  Top 0.152: 36.07,30.41 C15.2 | C15.2 36.5,30.02 37.31,30.02 SW3.1 38.66,28.67 | U2.52 35.11,31.16 | 35.11,31.16 R2.1 | C15.2 35.8,30.73 35.53,30.73 35.11,31.16
SCK  (via drill 0.35)
  Top 0.152: U2.30 26.19,21.11 26.19,24.74 24.61,26.32 v22.61,26.32
  Bottom 0.152: v22.61,26.32 20.26,26.32 19.66,25.71 U$1.2
SCL  (via drill 0.35)
  Top 0.152: U2.64 27.16,36.81 26.34,35.99 26.34,35.23 v24.38,33.27
  Bottom 0.152: U1.1 18.15,29.97 21.08,29.97 v24.38,33.27
SDA  (via drill 0.35)
  Top 0.152: U2.63 27.73,36.24 26.8,35.31 26.8,34.42 v25.27,32.89
  Bottom 0.152: U1.3 16.13,30.69 16.13,29.84 16.31,29.66 22.23,29.66 25.27,32.71 v25.27,32.89
SHIELD
  Top 0.152: 38.48,23.82 USB2.P4 USB2.P2 USB2.P1 38.78,17.77 | 38.48,23.82 USB2.P6 | USB2.P5 38.78,17.77 | USB2.P3 38.8,17.77 38.78,17.77 | 38.48,23.82 37.47,24.83 L1.1
SS  (via drill 0.35)
  Top 0.152: v18.92,25.53 18.92,26.04 20.07,27.18 24.64,27.18 26.8,25.02 26.8,20.86 25.15,19.2 25.15,17.8 U2.32
  Bottom 0.152: v18.92,25.53 18.92,24.26 | 18.92,24.26 18.92,23.95 | U$1.1 19,24.18 18.92,24.26
TH1
  Top 0.152: U2.16 15.11,27.28 10.29,27.28 7.61,24.6 6.72,24.6 | C22.2 6.72,23.79 6.72,24.6 | R5.2 6.72,24.6
V+  (via drill 0.35)
  Top 0.152: R9.2 14.61,23.54 CN1.3
  Top 0.406: U4.VIN 14.77,13.72 v16.89,13.72 | U$3.16 30.04,7.11 v30.61,7.11 C3.2 | U$3.9 24.98,7.11 v24.51,7.11 C13.2 CT1.+
  Bottom 0.152: 17.91,13.72 17.97,13.65
  Bottom 0.406: v30.61,7.11 v24.51,7.11 17.97,13.65 14.61,17.02 CN1.3 | v16.89,13.72 17.91,13.72
VBUS
  Top 0.152: F1.1 35.62,18.86 | 35.62,18.86 35.63,18.87 | 35.62,18.86 37.1,18.86 USB2.1
VREF1  (via drill 0.35)
  Top 0.152: U2.14 | v21.34,27.74 24.51,27.74 27.1,25.14 27.1,20.9 v27.69,20.32 | U2.14 17.91,28.83 17.91,28.57 17.91,28.5 17.91,28.45 v18.54,27.81 | v29.72,18.29 29.72,17.91 25.9,14.09 25.9,13.15 U$3.7
  Bottom 0.152: v29.72,18.29 v27.69,20.32 | v21.34,27.74 18.61,27.74 v18.54,27.81
VREF2  (via drill 0.35)
  Top 0.152: v24.34,34.84 | v24.34,34.84 U2.3 | v33.45,20.57 33.45,18.46 29.13,14.15 U$3.2
  Bottom 0.152: v24.34,34.84 26.04,33.15 26.04,29.01 30.15,24.89 32.13,24.89 33.45,23.57 v33.45,20.57
VSENSE
  Top 0.152: U2.19 16.64,24 15.62,24 13.72,25.9 13.24,25.9 R9.1 13.17,25.9 12.69,25.9 R10.2

### Text on the board
tPlace: 4
Reference: Joe Church